# EAGLE design Pro Mini Sensor Breakout (EAGLE 7.1.0)
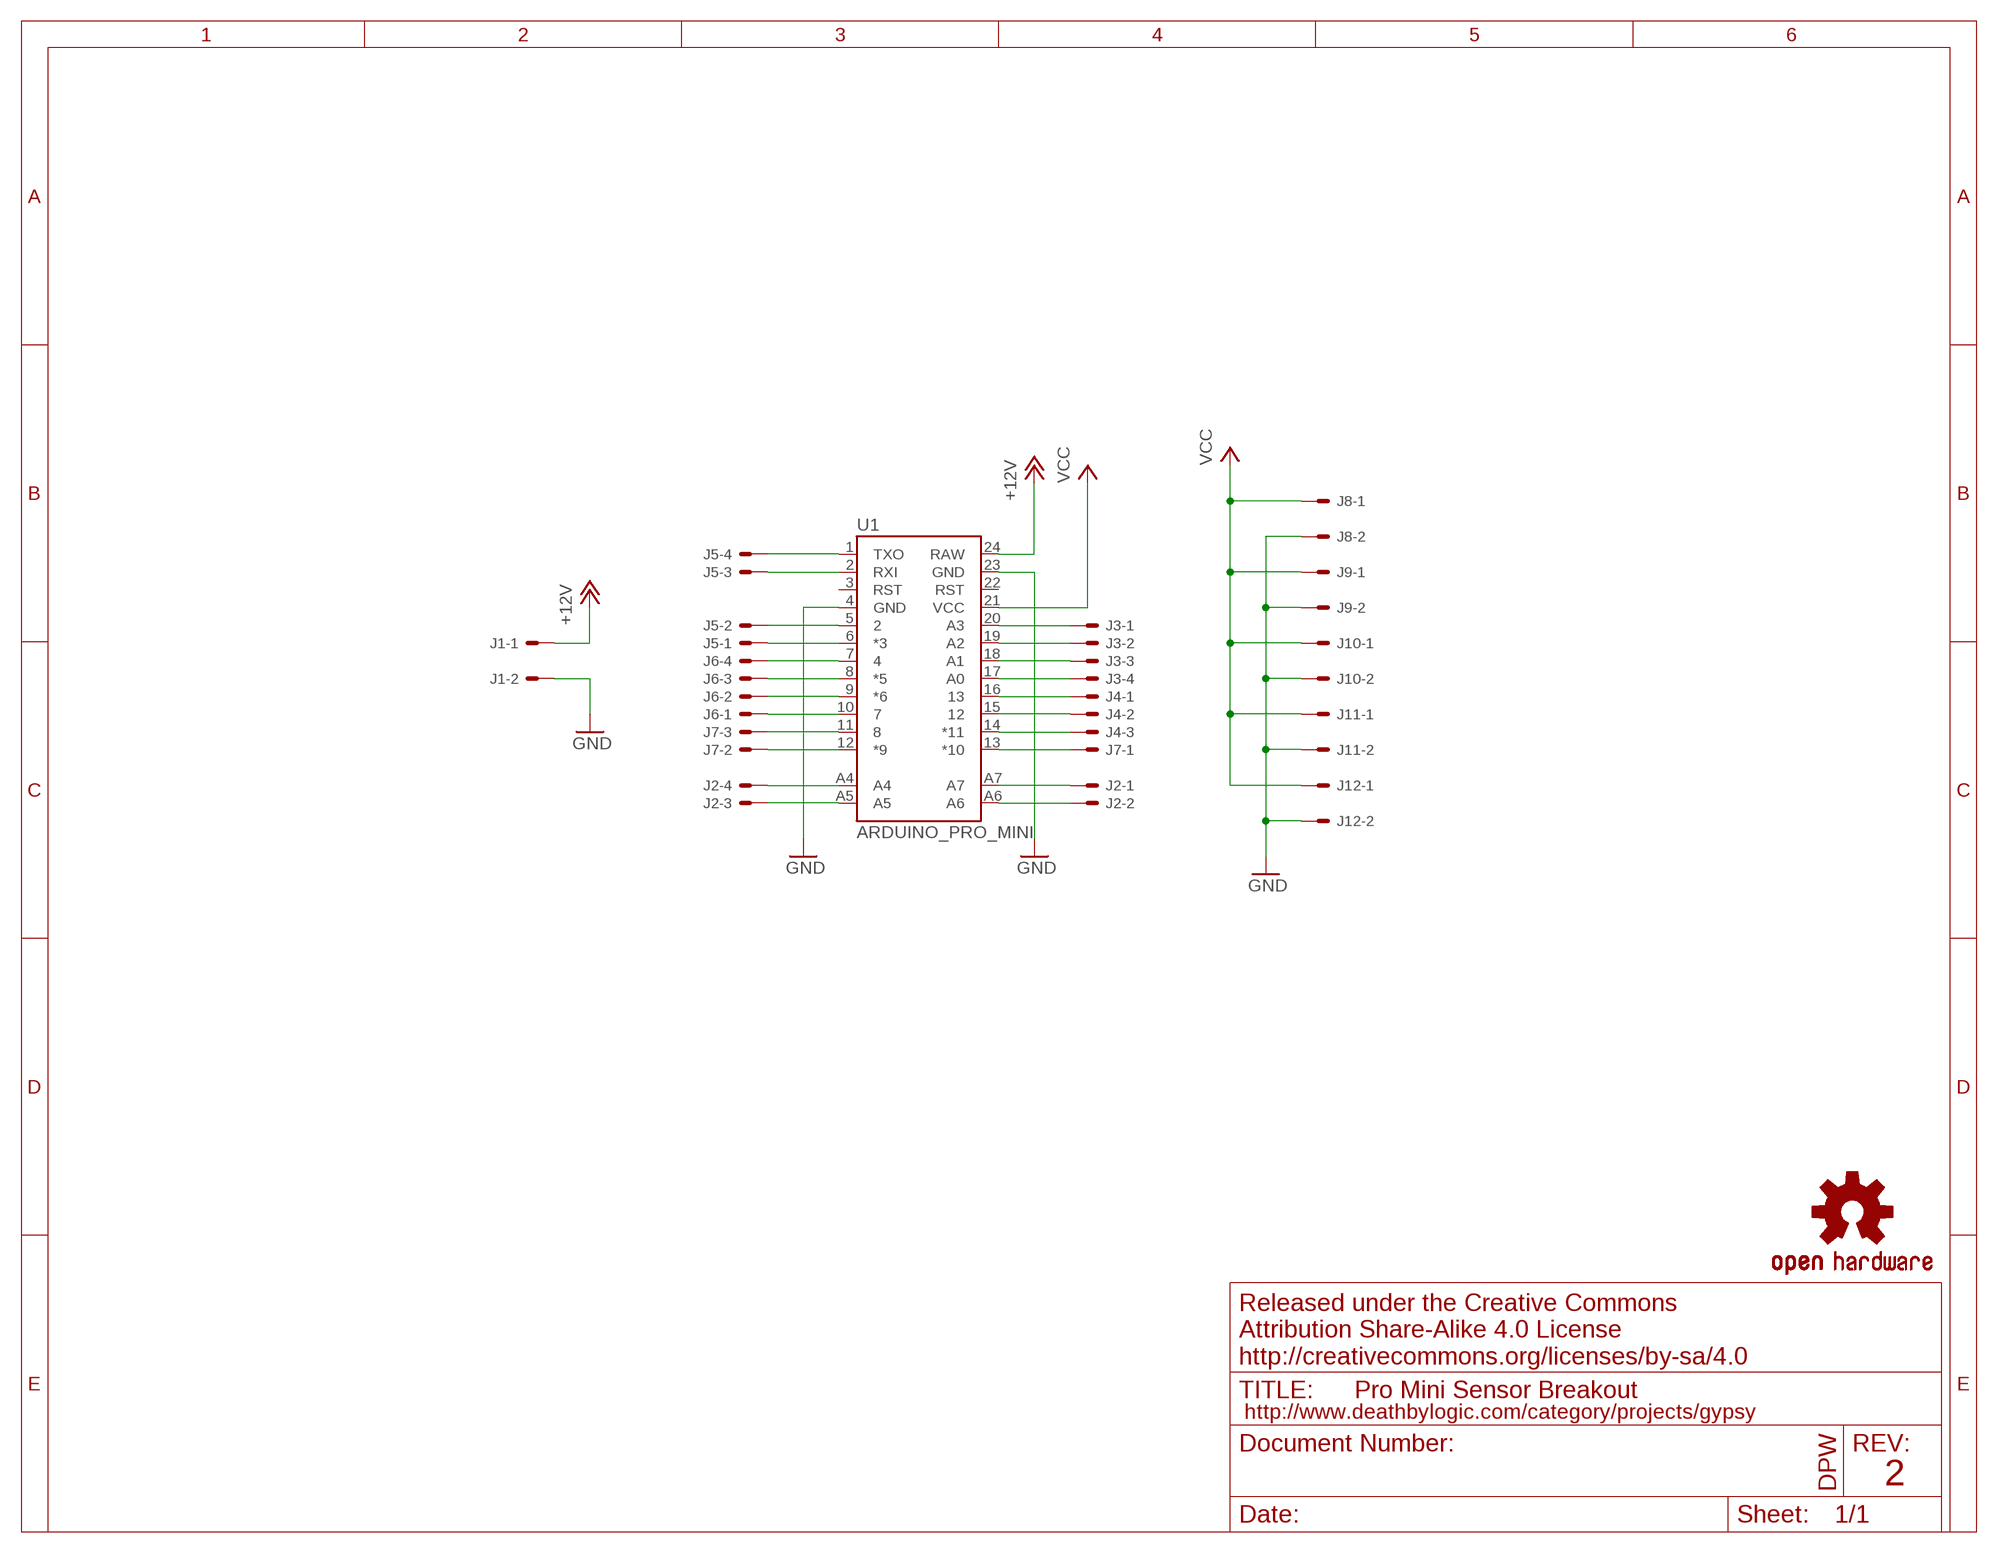
[diagram p0: schematic, sheet 1]

## Parts
J1  22-27-2021-02  [6410-02]
J2  22-27-2041-04  [6410-04]
J3  22-27-2041-04  [6410-04]
J4  22-27-2031-03  [6410-03]
J5  22-27-2041-04  [6410-04]
J6  22-27-2041-04  [6410-04]
J7  22-27-2031-03  [6410-03]
J8  22-27-2021-02  [6410-02]
J9  22-27-2021-02  [6410-02]
J10  22-27-2021-02  [6410-02]
J11  22-27-2021-02  [6410-02]
J12  22-27-2021-02  [6410-02]
LOGO2  OSHW-LOGOM  [OSHW-LOGO-M]
U1  ARDUINO_PRO_MINI  [ARDUINO_PRO_MINI]
U$6  PENGUIN_LOGOSILKSCREEN  [PENGUIN_SILKSCREEN]

## Nets
+12V: J1.1 U1.24(RAW)
GND: J1.2 J8.2 J9.2 J10.2 J11.2 J12.2 U1.4(GND) U1.23(GND)
N$1: J2.4 U1.A4
N$2: J2.3 U1.A5
N$4: J2.1 U1.A7
N$5: J2.2 U1.A6
N$6: J3.1 U1.20(A3)
N$7: J3.2 U1.19(A2)
N$8: J3.3 U1.18(A1)
N$9: J3.4 U1.17(A0)
N$10: J4.1 U1.16
N$11: J4.2 U1.15
N$12: J4.3 U1.14(*11)
N$13: J5.4 U1.1(TXO)
N$14: J5.3 U1.2(RXI)
N$15: J5.2 U1.5
N$16: J5.1 U1.6(*3)
N$17: J6.4 U1.7
N$18: J6.3 U1.8(*5)
N$19: J6.2 U1.9(*6)
N$20: J6.1 U1.10
N$21: J7.3 U1.11
N$22: J7.2 U1.12(*9)
N$23: J7.1 U1.13(*10)
VCC: J8.1 J9.1 J10.1 J11.1 J12.1 U1.21(VCC)
Unconnected: U1.3(RST) U1.22(RST)

## Notes on the sheet
- Released under the Creative Commons
  Attribution Share-Alike 4.0 License
  http://creativecommons.org/licenses/by-sa/4.0
- http://www.deathbylogic.com/category/projects/gypsy
- 2

## Library data of the parts
J1 J8-J12 = custom:22-?-02
J2 J3 J5 J6 = custom:22-?-04
J4 J7 = custom:22-?-03
LOGO2 = SparkFun-Aesthetics:OSHW-LOGO: Open Source Hardware Logo This logo indicates the piece of hardware it is found on incorporates a OSHW license and/or adheres to the definition of open source hardware found here: http://freedomdefined.org/OSHW
U1 = SparkFun-Boards:ARDUINO_PRO_MINI
U$6 = custom:PENGUIN_LOGO

## Board
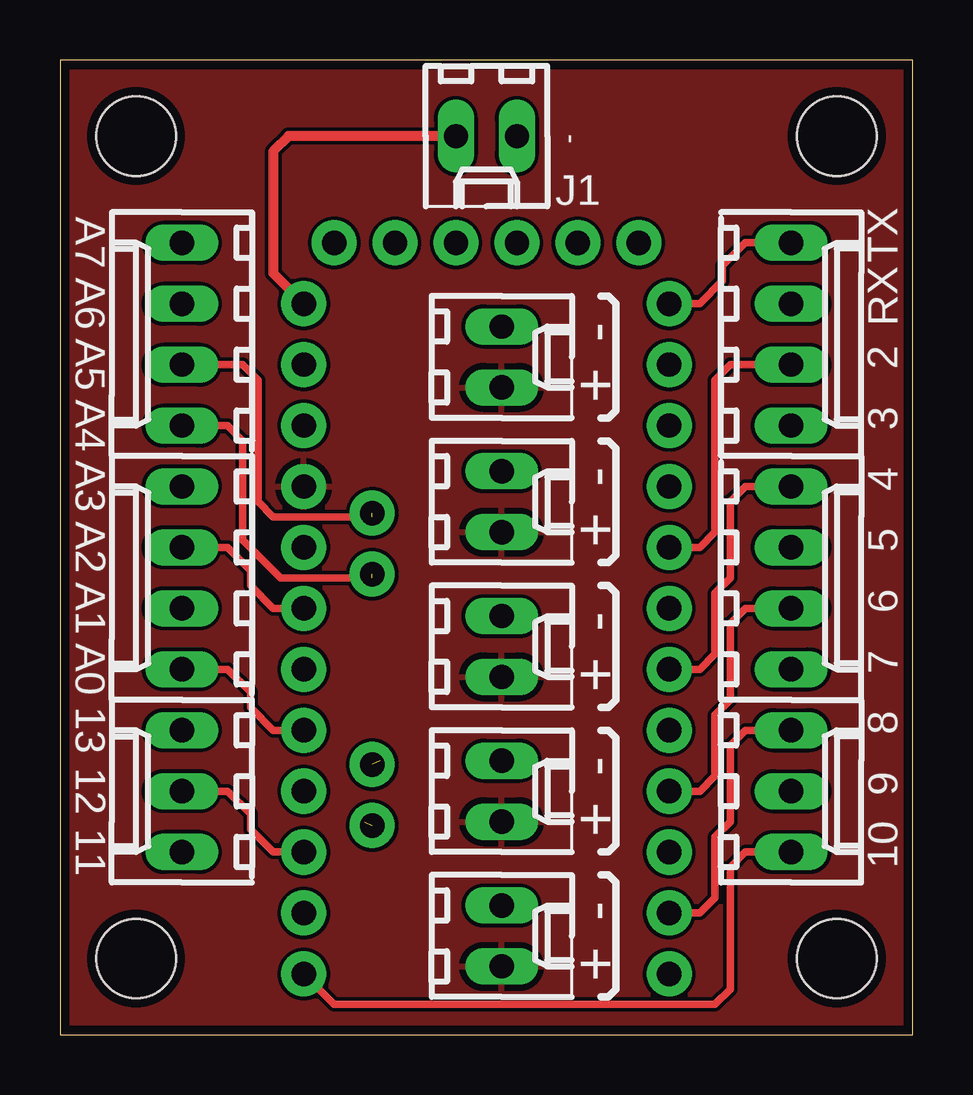
[diagram p1: board, top side]
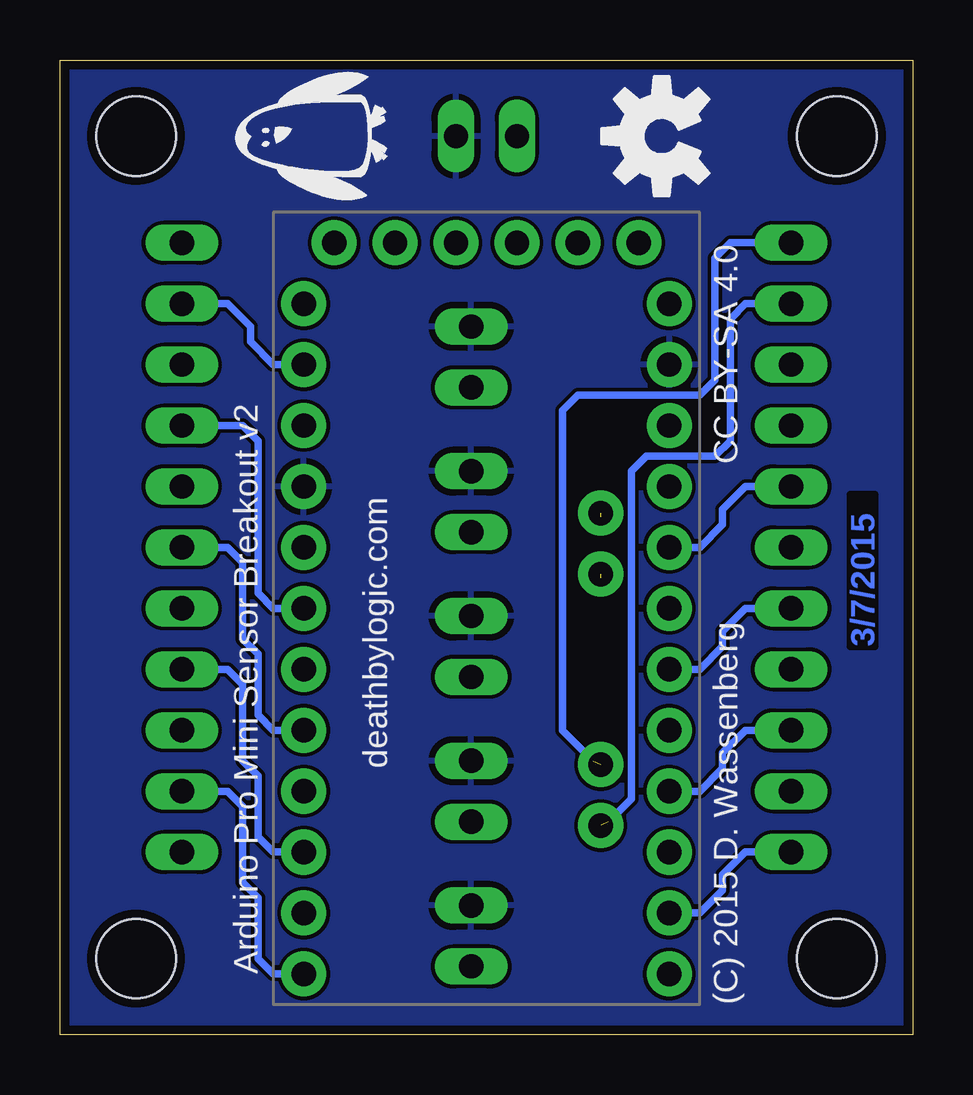
[diagram p2: board, bottom side, seen from below]

Size 35.56 x 40.64 mm. Coordinates in mm from the lower left corner, seen from the top.
Outline: 0,0 35.56,0 35.56,40.64 0,40.64 0,0
Copper layers (1*16): Top 0.0356mm / dielectric 1.5011mm / Bottom 0.0356mm
Design rules "LaenPCBOrder": minimum track width 6mil, minimum drill 13mil, track to track 6mil, track to pad 6mil, pad to pad 6mil, via to via 6mil, smd to smd 6mil, copper to edge 15mil, drill to drill 6mil, minimum pad ring 7mil, minimum via ring 7mil, stop-mask expansion 4mil, vias tented up to drill 0mil, thermal gap 10mil

### Footprints (pad centres in the part's own frame; a part is rotated, then mirrored left to right if it is on the bottom)
6410-02 = drill 1.016 long: 1 1.27,0; 2 -1.27,0
6410-04 = drill 1.016 long: 1 3.81,0; 2 1.27,0; 3 -1.27,0; 4 -3.81,0
6410-03 = drill 1.016 long: 1 2.54,0; 2 0,0; 3 -2.54,0
ARDUINO_PRO_MINI = drill 1.016 pad 1.88: 1 -7.62,12.7; 2 -7.62,10.16; 3 -7.62,7.62; 4 -7.62,5.08; 5 -7.62,2.54; 6 -7.62,0; 7 -7.62,-2.54; 8 -7.62,-5.08; 9 -7.62,-7.62; 10 -7.62,-10.16; 11 -7.62,-12.7; 12 -7.62,-15.24; 13 7.62,-15.24; 14 7.62,-12.7; 15 7.62,-10.16; 16 7.62,-7.62; 17 7.62,-5.08; 18 7.62,-2.54; 19 7.62,0; 20 7.62,2.54; 21 7.62,5.08; 22 7.62,7.62; 23 7.62,10.16; 24 7.62,12.7; A4 4.763,1.429; A5 4.763,3.969; A6 4.763,-9.049; A7 4.763,-6.509; BLK -6.35,15.24; GND -3.81,15.24; GRN 6.35,15.24; RXI 1.27,15.24; TXO 3.81,15.24; VCC -1.27,15.24
STAND-OFF = hole 3.302: 0,0

### Placement (x,y rotation side)
J1  17.78,37.47 180 top
J2  5.08,29.21 90 top
J3  5.08,19.05 90 top
J4  5.08,10.16 90 top
J5  30.48,29.21 270 top
J6  30.48,19.05 270 top
J7  30.48,10.16 270 top
J8  18.41,10.16 270 top
J9  18.41,22.23 270 top
J10  18.41,16.19 270 top
J11  18.41,4.13 270 top
J12  18.41,28.26 270 top
LOGO2  10.48,37.47 90 bottom
U1  17.78,17.78 0 bottom
U$2  [STAND-OFF]  3.17,3.17 0 top
U$3  [STAND-OFF]  32.38,37.47 0 top
U$4  [STAND-OFF]  3.17,37.47 0 top
U$5  [STAND-OFF]  32.38,3.17 0 top
U$6  25.08,37.47 90 bottom

### Tracks (layer width: path | path; a pad name or v marks a point on that pad's centre or on a via)
+12V
  Top 0.406: J1.1 9.53,37.47 8.89,36.83 8.89,31.75 U1.24
GND
  pour Bottom: 0,0 0,40.64 35.56,40.64 35.56,0
N$1  (1 unrouted)
  Top 0.305: J2.4 6.99,25.4 7.62,24.77 7.62,20.64 9.21,19.05 13.02,19.05
N$2  (1 unrouted)
  Top 0.305: J2.3 7.62,27.94 8.26,27.3 8.26,22.23 8.89,21.59 13.02,21.59
N$4  (1 unrouted)
  Bottom 0.305: J2.1 7.62,33.02 8.26,32.38 8.26,27.3 8.89,26.67 13.97,26.67 14.61,26.04 14.61,12.7 13.34,11.43
N$5  (1 unrouted)
  Bottom 0.305: J2.2 6.99,30.48 7.62,29.84 7.62,24.77 8.26,24.13 11.11,24.13 11.75,23.5 11.75,9.84 12.7,8.89
N$6
  Bottom 0.305: U1.20 8.89,20.32 7.94,21.27 7.94,21.91 6.99,22.86 J3.1
N$7
  Top 0.305: U1.19 8.89,17.78 7.94,18.73 7.94,19.37 6.99,20.32 J3.2
N$8
  Bottom 0.305: U1.18 8.89,15.24 7.94,16.19 7.94,16.83 6.99,17.78 J3.3
N$9
  Top 0.305: U1.17 8.89,12.7 7.94,13.65 7.94,14.29 6.99,15.24 J3.4
N$10
  Bottom 0.305: U1.16 8.89,10.16 7.94,11.11 7.94,11.75 6.99,12.7 J4.1
N$11
  Top 0.305: U1.15 8.89,7.62 7.94,8.57 7.94,9.21 6.99,10.16 J4.2
N$12
  Bottom 0.305: U1.14 8.89,5.08 7.94,6.03 7.94,6.67 6.99,7.62 J4.3
N$13
  Top 0.305: J5.4 28.57,33.02 27.62,32.07 27.62,31.43 26.67,30.48 U1.1
N$14
  Bottom 0.305: J5.3 28.57,30.48 27.62,29.53 27.62,28.89 26.67,27.94 U1.2
N$15
  Top 0.305: J5.2 27.94,27.94 27.3,27.3 27.3,20.95 26.67,20.32 U1.5
N$16
  Bottom 0.305: J5.1 27.94,25.4 27.3,24.77 27.3,18.41 26.67,17.78 U1.6
N$17
  Top 0.305: J6.4 28.57,22.86 27.94,22.23 27.94,19.05 27.3,18.41 27.3,15.88 26.67,15.24 U1.7
N$18
  Bottom 0.305: J6.3 28.57,20.32 27.94,19.68 27.94,16.51 27.3,15.88 27.3,13.34 26.67,12.7 U1.8
N$19
  Top 0.305: J6.2 28.57,17.78 27.94,17.14 27.94,13.97 27.3,13.34 27.3,10.79 26.67,10.16 U1.9
N$20
  Bottom 0.305: J6.1 28.57,15.24 27.94,14.61 27.94,11.43 27.3,10.79 27.3,8.26 26.67,7.62 U1.10
N$21
  Top 0.305: J7.3 28.57,12.7 27.94,12.06 27.94,8.89 27.3,8.26 27.3,5.71 26.67,5.08 U1.11
N$22
  Bottom 0.305: J7.2 28.57,10.16 27.94,9.53 27.94,6.35 27.3,5.71 27.3,3.17 26.67,2.54 U1.12
N$23
  Top 0.305: J7.1 28.57,7.62 27.94,6.99 27.94,1.91 27.3,1.27 11.43,1.27 U1.13
VCC
  pour Top: 0,0 0,40.64 35.56,40.64 35.56,0

### Text on the board
Bottom: 3/7/2015
tPlace: - | A7 | TX | RX | A6 | - | A5 | 2 | + | 3 | A4 | A3 | - | 4 | 5 | A2 | + | A1 | 6 | - | 7 | A0 | + | 13 | 8 | - | 12 | 9 | 11 | + | 10 | - | +
bPlace: CC BY-SA 4.0 | deathbylogic.com | Arduino Pro Mini Sensor Breakout v2 | (C) 2015 D. Wassenberg
tDocu: +5.0-12V